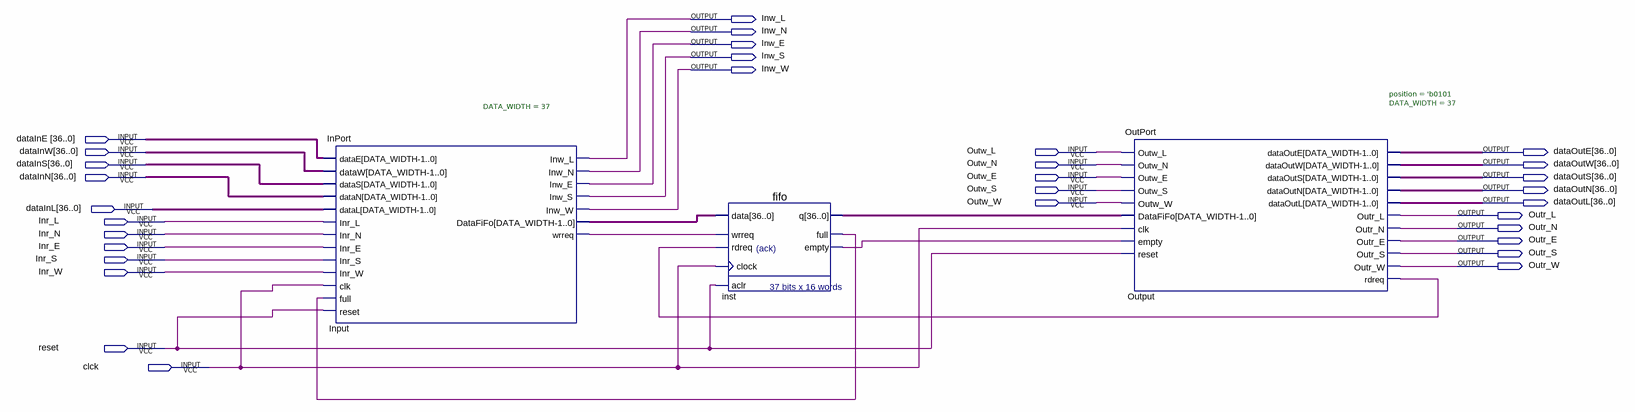
[diagram p0: schematic sheet]
// Quartus schematic NoCSimp3_sw.bdf as structural Verilog: 3 symbols, 32 pins
module NoCSimp3_sw (
  input  [36:0] dataInE,
  input  [36:0] dataInW,
  input  Outw_L,
  input  [36:0] dataInS,
  input  Outw_N,
  input  [36:0] dataInN,
  input  Outw_E,
  input  Outw_S,
  input  Outw_W,
  input  [36:0] dataInL,
  input  Inr_L,
  input  Inr_N,
  input  Inr_E,
  input  Inr_S,
  input  Inr_W,
  input  reset,
  input  clck,
  output Inw_L,
  output Inw_N,
  output Inw_E,
  output Inw_S,
  output Inw_W,
  output [36:0] dataOutE,
  output [36:0] dataOutW,
  output [36:0] dataOutS,
  output [36:0] dataOutN,
  output [36:0] dataOutL,
  output Outr_L,
  output Outr_N,
  output Outr_E,
  output Outr_S,
  output Outr_W
);

  wire Input_wrreq, inst_empty, inst_full, Output_rdreq;
  wire [36:0] Input_datafifo, inst_q;

  InPort #(.DATA_WIDTH(37)) Input (
    .dataE(dataInE), .dataW(dataInW), .dataS(dataInS), .dataN(dataInN), .dataL(dataInL), .Inr_L(Inr_L),
    .Inr_N(Inr_N), .Inr_E(Inr_E), .Inr_S(Inr_S), .Inr_W(Inr_W), .clk(clck), .full(inst_full), .reset(reset),
    .Inw_L(Inw_L), .Inw_N(Inw_N), .Inw_E(Inw_E), .Inw_S(Inw_S), .Inw_W(Inw_W), .DataFiFo(Input_datafifo),
    .wrreq(Input_wrreq));
  fifo inst (
    .data(Input_datafifo), .wrreq(Input_wrreq), .rdreq(Output_rdreq), .clock(clck), .aclr(reset), .q(inst_q),
    .full(inst_full), .empty(inst_empty));
  OutPort #(.position('b0101), .DATA_WIDTH(37)) Output (
    .Outw_L(Outw_L), .Outw_N(Outw_N), .Outw_E(Outw_E), .Outw_S(Outw_S), .Outw_W(Outw_W), .DataFiFo(inst_q),
    .clk(clck), .empty(inst_empty), .reset(reset), .dataOutE(dataOutE), .dataOutW(dataOutW),
    .dataOutS(dataOutS), .dataOutN(dataOutN), .dataOutL(dataOutL), .Outr_L(Outr_L), .Outr_N(Outr_N),
    .Outr_E(Outr_E), .Outr_S(Outr_S), .Outr_W(Outr_W), .rdreq(Output_rdreq));
endmodule
